# EAGLE design SurfaceEEG_E_V1.3 (EAGLE 7.6.0)
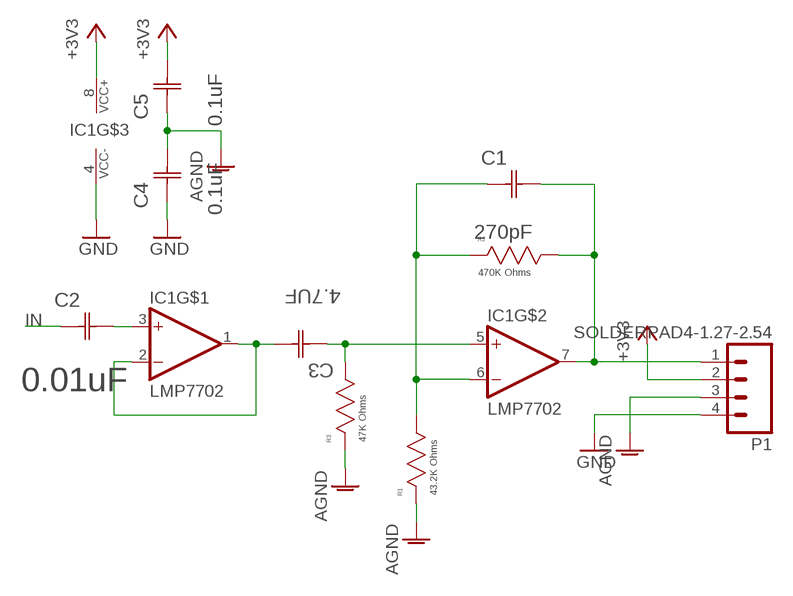
[diagram p0: schematic, sheet 1]

## Parts
C1  270pF  06035A271JAT2A  [CAPC1608X90N]
C2  0.01uF  C0402C103J3RACTU  [CAPC1005X60N]
C3  4.7UF  06036D475MAT2A  [CAPC1608X90N]
C4  0.1uF  04023C104KAT2A  [CAPC1005X60N]
C5  0.1uF  04023C104KAT2A  [CAPC1005X60N]
IC1  LMP7702  [VSSOP8]
P1  SOLDERPAD4-1.27-2.54  [SMD1,27-2,54]
R1  43.2K Ohms  RC0603FR-0743K2L  [RESC1608X60N]
R2  470K Ohms  RC0603FR-07470KL  [RESC1608X60N]
R3  47K Ohms  RC0603FR-0747KL  [RESC1608X60N]

## Nets
+3V3: C5.1(C2) IC1.8(VCC+) P1.2
AGND: C4.1(C2) C5.2(C1) P1.3 R1.2(R2) R3.2(R2)
GND: C4.2(C1) IC1.4(VCC-) P1.4
IN: C2.1(C1)
N$1: C2.2(C2) IC1.3(IN+)
N$2: C1.1(C1) IC1.6(IN-) R1.1(R1) R2.2(R2)
N$3: C3.1(C1) IC1.5(IN+) R3.1(R1)
N$4: C1.2(C2) IC1.7(OUT) P1.1 R2.1(R1)
SHIELD: C3.2(C2) IC1.1(OUT) IC1.2(IN-)

## Library data of the parts
C1 = (manufact)-capacitors-AVX-element14:06035A271JAT2A: CAPACITOR , 0603; MPN: 06035A271JAT2A; OC_FARNELL: 1734627; OC_NEWARK: 96M1275; SUPPLIER: AVX; TOLERANCE: ± 5%; VOLTAGERATING: 50V
C2 = (manufact)-Kemet-element14:C0402C103J3RACTU: CAPACITOR, 0402; MPN: C0402C103J3RACTU; OC_FARNELL: 1692285; OC_NEWARK: 78H4779; SUPPLIER: Kemet; TOLERANCE: ±5%; VOLTAGERATING: 25V
C3 = (manufact)-capacitors-AVX-element14:06036D475MAT2A: Capacitor, 0603; MPN: 06036D475MAT2A; OC_FARNELL: 1740638; OC_NEWARK: 96M1296; SUPPLIER: AVX; TOLERANCE: ±20%; VOLTAGERATING: 6.3V
C4 C5 = (manufact)-capacitors-AVX-element14:04023C104KAT2A: Capacitor 0402; MPN: 04023C104KAT2A; OC_FARNELL: 1867948; OC_NEWARK: 37T9047; SUPPLIER: AVX; TOLERANCE: ±10%; VOLTAGERATING: 25V
IC1 = (custom)-new-components:LMP7702: The library has been designed by Richard Magdycz <https://www.facebook.com/groups/eaglecadsoftUK>; MPN: LMP7702MM/NOPB
P1 = (custom)-new-components:SOLDERPAD4-1.27-2.54
R1 = (manufact)-resistors-YAGEO-element14:RC0603FR-0743K2L: RESISTOR, 0603; MPN: RC0603FR-0743K2L; OC_FARNELL: -; OC_NEWARK: 19P7489; SUPPLIER: Yageo; TOLERANCE: ±1%; WATTAGE: 1/10 W
R2 = (manufact)-resistors-YAGEO-element14:RC0603FR-07470KL: RESISTOR, 0603; MPN: RC0603FR-07470KL; OC_FARNELL: 1117267; OC_NEWARK: 68R0098; SUPPLIER: Yageo; TOLERANCE: ±1%; WATTAGE: 1/10 W
R3 = (manufact)-resistors-YAGEO-element14:RC0603FR-0747KL: RESISTOR, 0603; MPN: RC0603FR-0747KL; OC_FARNELL: 1117266; OC_NEWARK: 26M6759; SUPPLIER: Yageo; TOLERANCE: ±1%; WATTAGE: 1/10 W

## Board
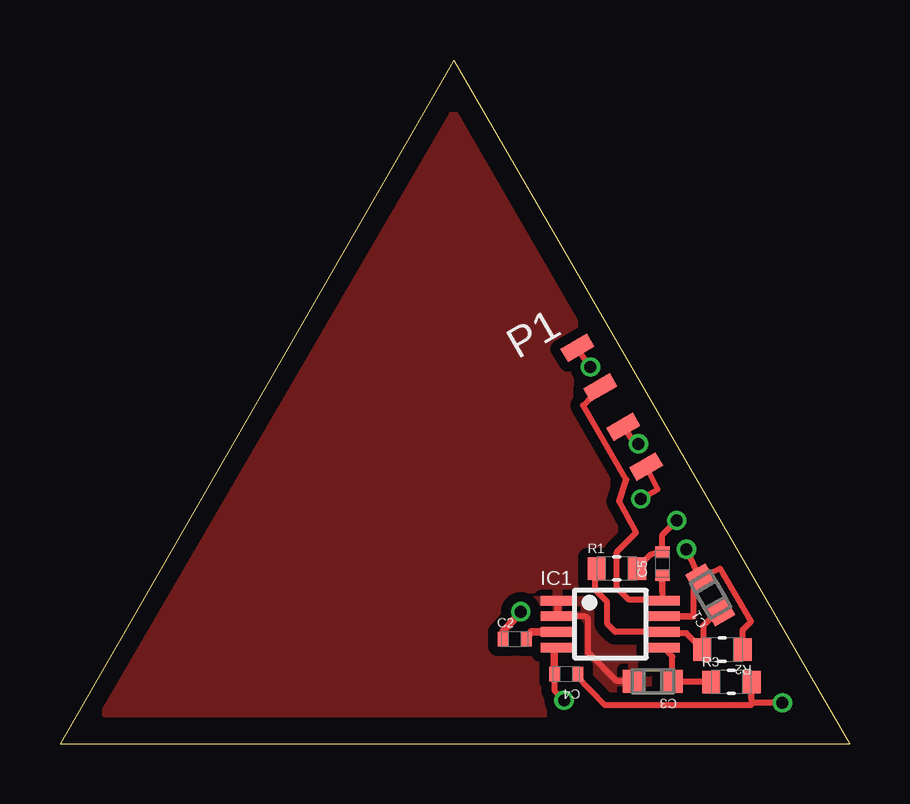
[diagram p1: board, top side]
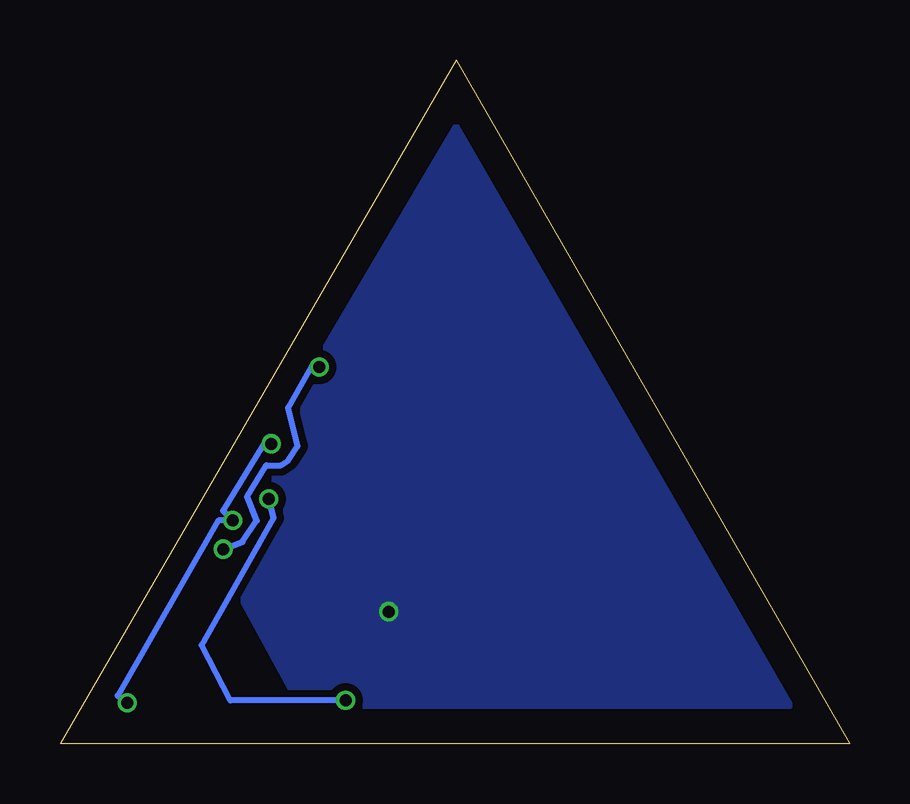
[diagram p2: board, bottom side, seen from below]

Size 32.9 x 28.5 mm. Coordinates in mm from the lower left corner, seen from the top.
Outline: 0,0 32.9,0 16.4,28.5 0,0
Copper layers (1*16): Top 0.035mm / dielectric 1.5mm / Bottom 0.035mm
Design rules "rules_Kharkiv": minimum track width 8mil, minimum drill 15mil, track to track 0.2mm, track to pad 0.2mm, pad to pad 0.2mm, via to via 0.2mm, smd to smd 0.2mm, copper to edge 0.7mm, drill to drill 8mil, minimum pad ring 7mil, minimum via ring 6mil, stop-mask expansion 4mil, vias tented up to drill 0mil, thermal gap 10mil

### Footprints (pad centres in the part's own frame; a part is rotated, then mirrored left to right if it is on the bottom)
CAPC1608X90N = smd 0.864 x 0.965: 1 -0.813,0; 2 0.813,0
CAPC1005X60N = smd 0.457 x 0.61: 1 -0.483,0; 2 0.483,0
VSSOP8 = smd 1.4 x 0.4: 1 -2.2,0.975; 2 -2.2,0.325; 3 -2.2,-0.325; 4 -2.2,-0.975; 5 2.2,-0.975; 6 2.2,-0.325; 7 2.2,0.325; 8 2.2,0.975
SMD1,27-2,54 = smd 0.635 x 1.27: 1 0,0; 2 1.905,0; 3 3.81,0; 4 5.715,0
RESC1608X60N = smd 0.762 x 0.94: 1 -0.838,0; 2 0.838,0

### Placement (x,y rotation side)
C1  27.1,6.2 120 top
C2  18.95,4.36 0 top
C3  24.7,2.6 180 top
C4  21.1,2.9 180 top
C5  25.1,7.5 90 top
IC1  22.93,4.98 0 top
P1  21.56,16.5 300 top
R1  23.2,7.3 0 top
R2  27.6,3.92 180 top
R3  27.97,2.57 0 top

### Tracks (layer width: path | path; a pad name or v marks a point on that pad's centre or on a via)
+3V3
  Top 0.254: IC1.8 25.13,6.03 25.1,6.4 C5.1 25.1,6 23.7,6 23.2,6.5 23.2,8 24,8.8 23.3,10.1 23.6,11 21.8,14.1 P1.2
AGND  (via drill 0.5 pad 0.25)
  Top 0.254: R1.2 24.62,7.88 C5.2 25.1,8.7 v25.7,9.3 | R3.2 28.81,2.01 | 28.81,2.01 28.8,1.6 22.7,1.6 21.5,2.82 C4.1 | v30.1,1.7 28.82,1.7 28.81,2.01 | v24.1,12.5 23.9,12.6 P1.3
  Bottom 0.254: v30.1,1.7 30.5,2 26.3,9.3 v25.7,9.3 26.1,9.7 24.2,12.8 v24.1,12.5
GND  (via drill 0.5 pad 0.25)
  Top 0.254: IC1.4 20.6,3.9 20.6,2.2 v21,1.8 | v24.2,10.2 24.9,10.6 P1.4
  Top 0.305: IC1.4 20.59,3.86 20.59,2.83 C4.2
  Bottom 0.254: v21,1.8 25.8,1.8 27,4.1 24,9.4 v24.2,10.2
IN  (via drill 0.5 pad 0.3)
  Top 0.305: C2.1 18.47,4.67 v19.2,5.5 19.23,5.47 19.17,5.47
  pour Bottom (isolate 0.305): 16.4,25.7 2.5,1.6 22.9,1.6 26.6,8.4
N$1
  Top 0.305: IC1.3 19.63,4.65 C2.2
N$2
  Top 0.254: C1.1 27.5,5.6 26.8,4.9 26.8,4.16 R2.2 26.58,4.12 26.1,4.6 25.18,4.6 IC1.6 23.14,4.65 22.8,5 22.8,5.9 22.3,6.4 22.3,7.24 R1.1
N$3
  Top 0.254: R3.1 25.54,2.57 C3.1 25.51,3.62 IC1.5
N$4  (via drill 0.5 pad 0.25)
  Top 0.254: 26.4,6.4 C1.2 27.5,7.3 28.8,5.1 28.44,4.74 R2.1 | 26.4,5.3 IC1.7 26.39,5.3 26.4,5.3 | 26.4,5.3 26.4,6.4 | 26.4,6.4 26.5,6.5 26.5,6.6 26.7,6.8 v26.1,8.1 | v22.1,15.7 P1.1
  Bottom 0.254: v26.1,8.1 25.3,8.4 24.7,9.3 25.1,10.3 24.3,11.6 23.7,11.6 23.4,11.8 23,12.4 23.4,14 22.3,15.9 v22.1,15.7
SHIELD
  Top 0.254: C3.2 23.2,2.6 22,3.8 22,5.2 21.9,5.3 IC1.2
  Top 0.305: IC1.1 IC1.2
  pour Top (isolate 0.406): 16.4,26.2 1.9,1.3 30.8,1.3